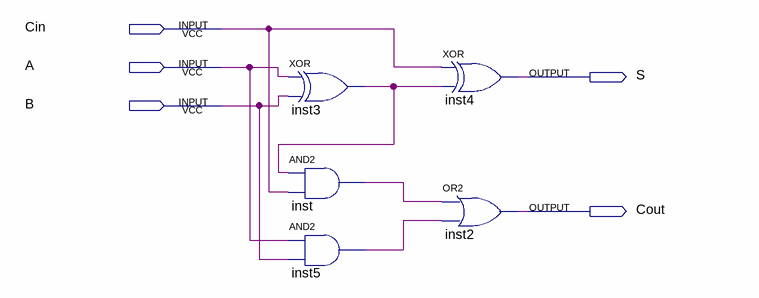
[diagram p0: schematic sheet]
// Quartus schematic full-adder.bdf as structural Verilog: 5 symbols, 5 pins
module \full-adder  (
  input  Cin,
  input  A,
  input  B,
  output S,
  output Cout
);

  wire inst3_out, inst5_out, inst_out;

  xor inst3 (inst3_out, A, B);
  and inst (inst_out, inst3_out, Cin);
  and inst5 (inst5_out, A, B);
  xor inst4 (S, Cin, inst3_out);
  or inst2 (Cout, inst_out, inst5_out);
endmodule
